# EAGLE schematic nixie-v-rev-b (EAGLE 9.6.2)

## Sheet 1 of 5: USB-C Connector & Power Supply
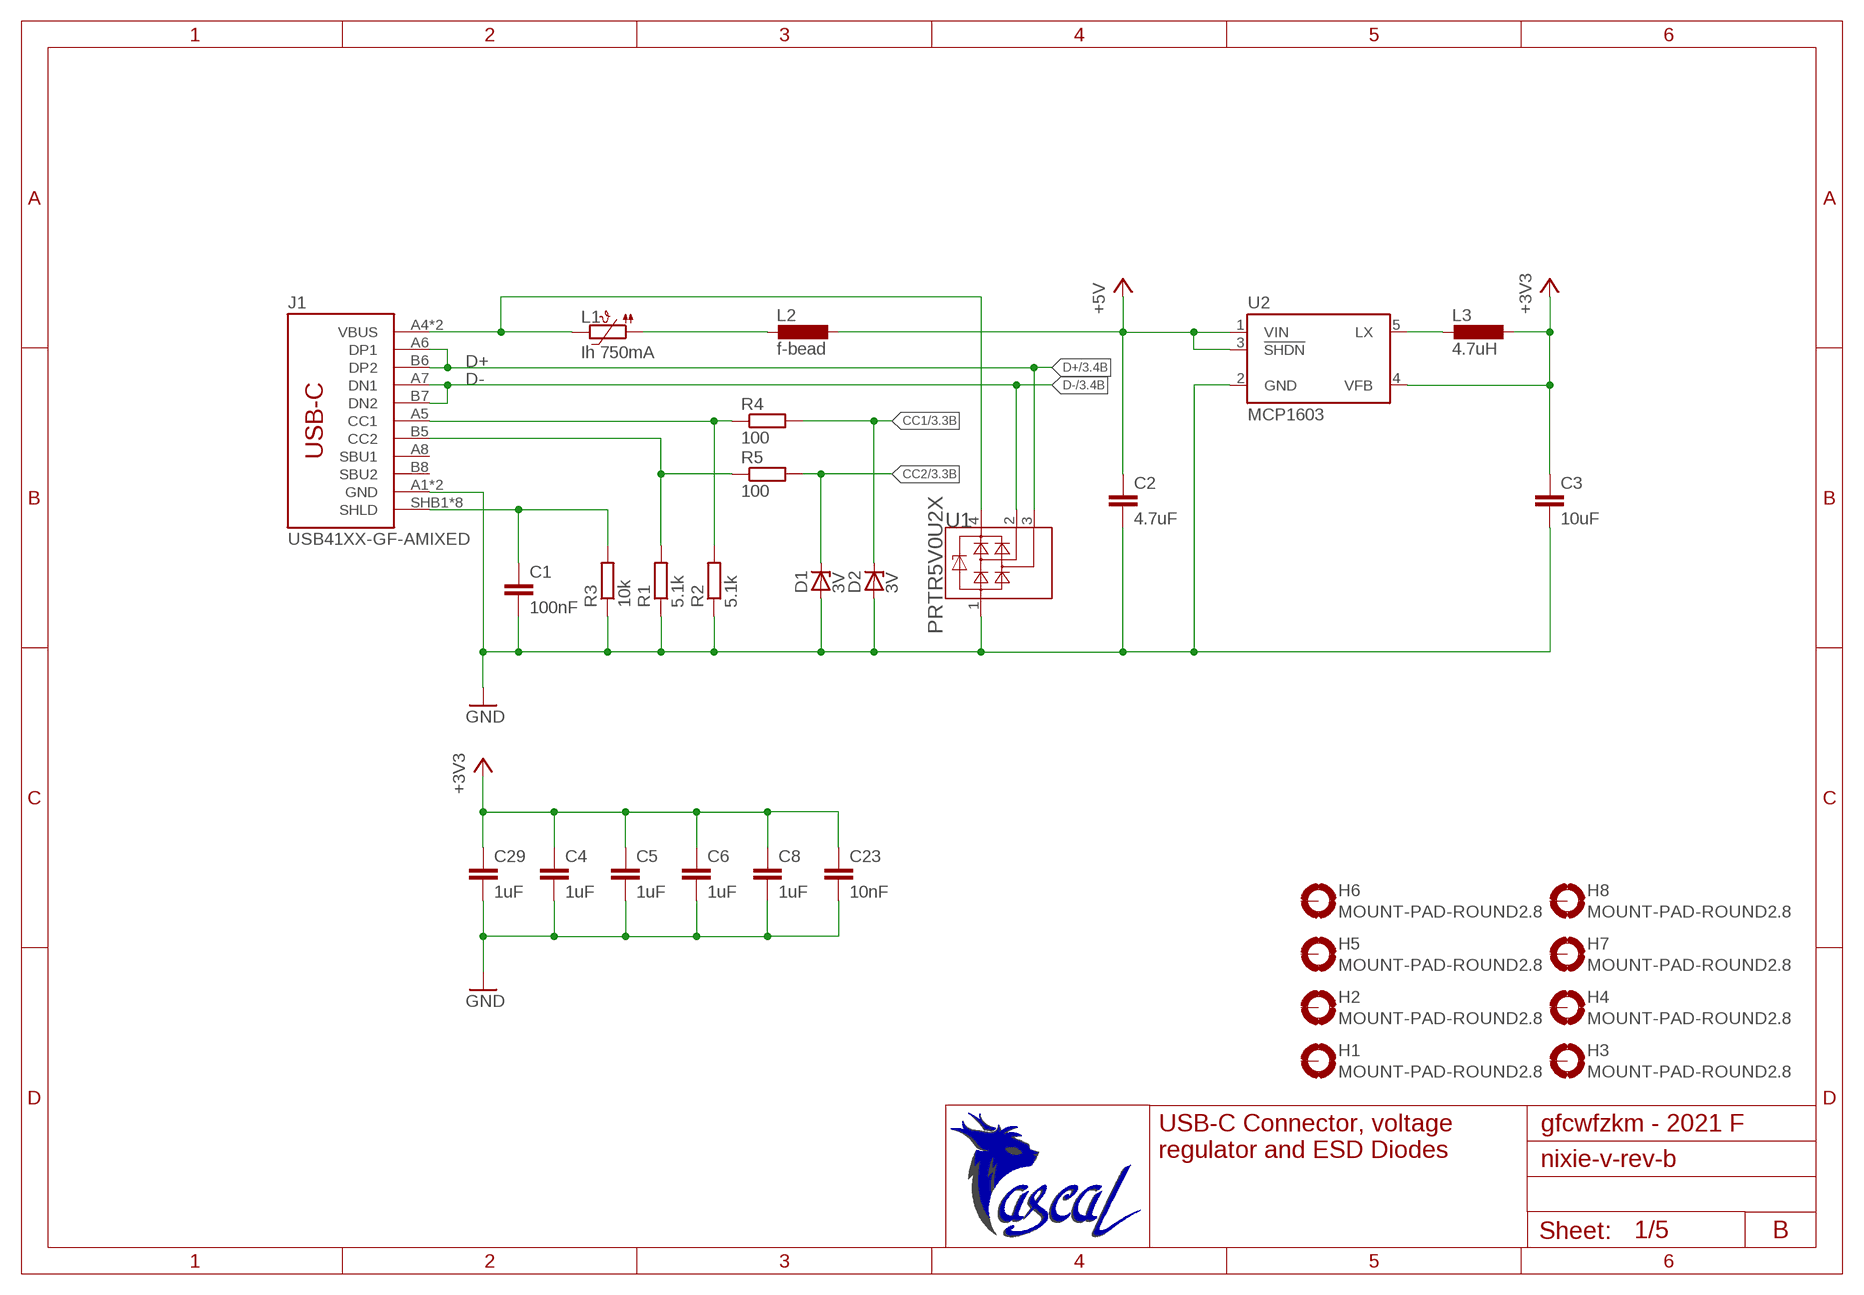
[diagram p0: schematic, sheet 1]

### Parts
C1  100nF  C-EUC0603  [C0603]
C2  4.7uF  C-EUC0805  [C0805]
C3  10uF  C-EUC0805  [C0805]
C4  1uF  C-EUC0603  [C0603]
C5  1uF  C-EUC0603  [C0603]
C6  1uF  C-EUC0603  [C0603]
C8  1uF  C-EUC0603  [C0603]
C23  10nF  C-EUC0603  [C0603]
C29  1uF  C-EUC0603  [C0603]
D1  3V  VESD05A1-02V-G3-08  [SOD-523]
D2  3V  VESD05A1-02V-G3-08  [SOD-523]
H1  MOUNT-PAD-ROUND2.8  [2,8-PAD]
H2  MOUNT-PAD-ROUND2.8  [2,8-PAD]
H3  MOUNT-PAD-ROUND2.8  [2,8-PAD]
H4  MOUNT-PAD-ROUND2.8  [2,8-PAD]
H5  MOUNT-PAD-ROUND2.8  [2,8-PAD]
H6  MOUNT-PAD-ROUND2.8  [2,8-PAD]
H7  MOUNT-PAD-ROUND2.8  [2,8-PAD]
H8  MOUNT-PAD-ROUND2.8  [2,8-PAD]
J1  USB41XX-GF-AMIXED  [USB4105-GF-A]
L1  Ih 750mA  PTC_FUSE0805  [R0805]
L2  f-bead  L-COIL  [R0805]
L3  4.7uH  L1210  [R1210]
R1  5.1k  R-EU_R0603  [R0603]
R2  5.1k  R-EU_R0603  [R0603]
R3  10k  R-EU_R0603  [R0603]
R4  100  R-EU_R0603  [R0603]
R5  100  R-EU_R0603  [R0603]
U1  PRTR5V0U2X  [SOT143B]
U2  MCP1603  [TSOT23-5]
U$1  LOGO_PASCAL_GESELL30MM  [LOGO_30MM]

### Nets
+3V3: C3.1 C4.1 C5.1 C6.1 C8.1 C23.1 C29.1 L3.1 U2.4(VFB) ; also sheet 3
+5V: C2.1 L2.1 U2.1(VIN) U2.3(!SHDN) ; also sheet 2
CC1: D2.C R4.2 ; also sheet 3
CC2: D1.C R5.2 ; also sheet 3
D+: J1.A6(DP1) J1.B6(DP2) U1.3 ; also sheet 3
D-: J1.A7(DN1) J1.B7(DN2) U1.2 ; also sheet 3
GND: C1.2 C2.2 C3.2 C4.2 C5.2 C6.2 C8.2 C23.2 C29.2 D1.A D2.A J1.A1(GND) J1.B1(GND) R1.1 R2.1 R3.1 U1.1 U2.2(GND) ; also sheet 2,3
LX: L3.2 U2.5(LX)
N$1: C1.1 J1.SHB1(SHLD) J1.SHB2(SHLD) J1.SHB3(SHLD) J1.SHB4(SHLD) J1.SHT1(SHLD) J1.SHT2(SHLD) J1.SHT3(SHLD) J1.SHT4(SHLD) R3.2
N$2: J1.B5(CC2) R1.2 R5.1
N$3: J1.A5(CC1) R2.2 R4.1
N$5: L1.1 L2.2
VBUS: J1.A4(VBUS) J1.B4(VBUS) L1.2 U1.4
Unconnected: H1.B2,8(MOUNT) H2.B2,8(MOUNT) H3.B2,8(MOUNT) H4.B2,8(MOUNT) H5.B2,8(MOUNT) H6.B2,8(MOUNT) H7.B2,8(MOUNT) H8.B2,8(MOUNT) J1.A8(SBU1) J1.B8(SBU2)

### Notes on the sheet
- USB-C Connector, voltage
  regulator and ESD Diodes
- gfcwfzkm - 2021 F
- B

## Sheet 2 of 5: High Voltage Nixie Booster
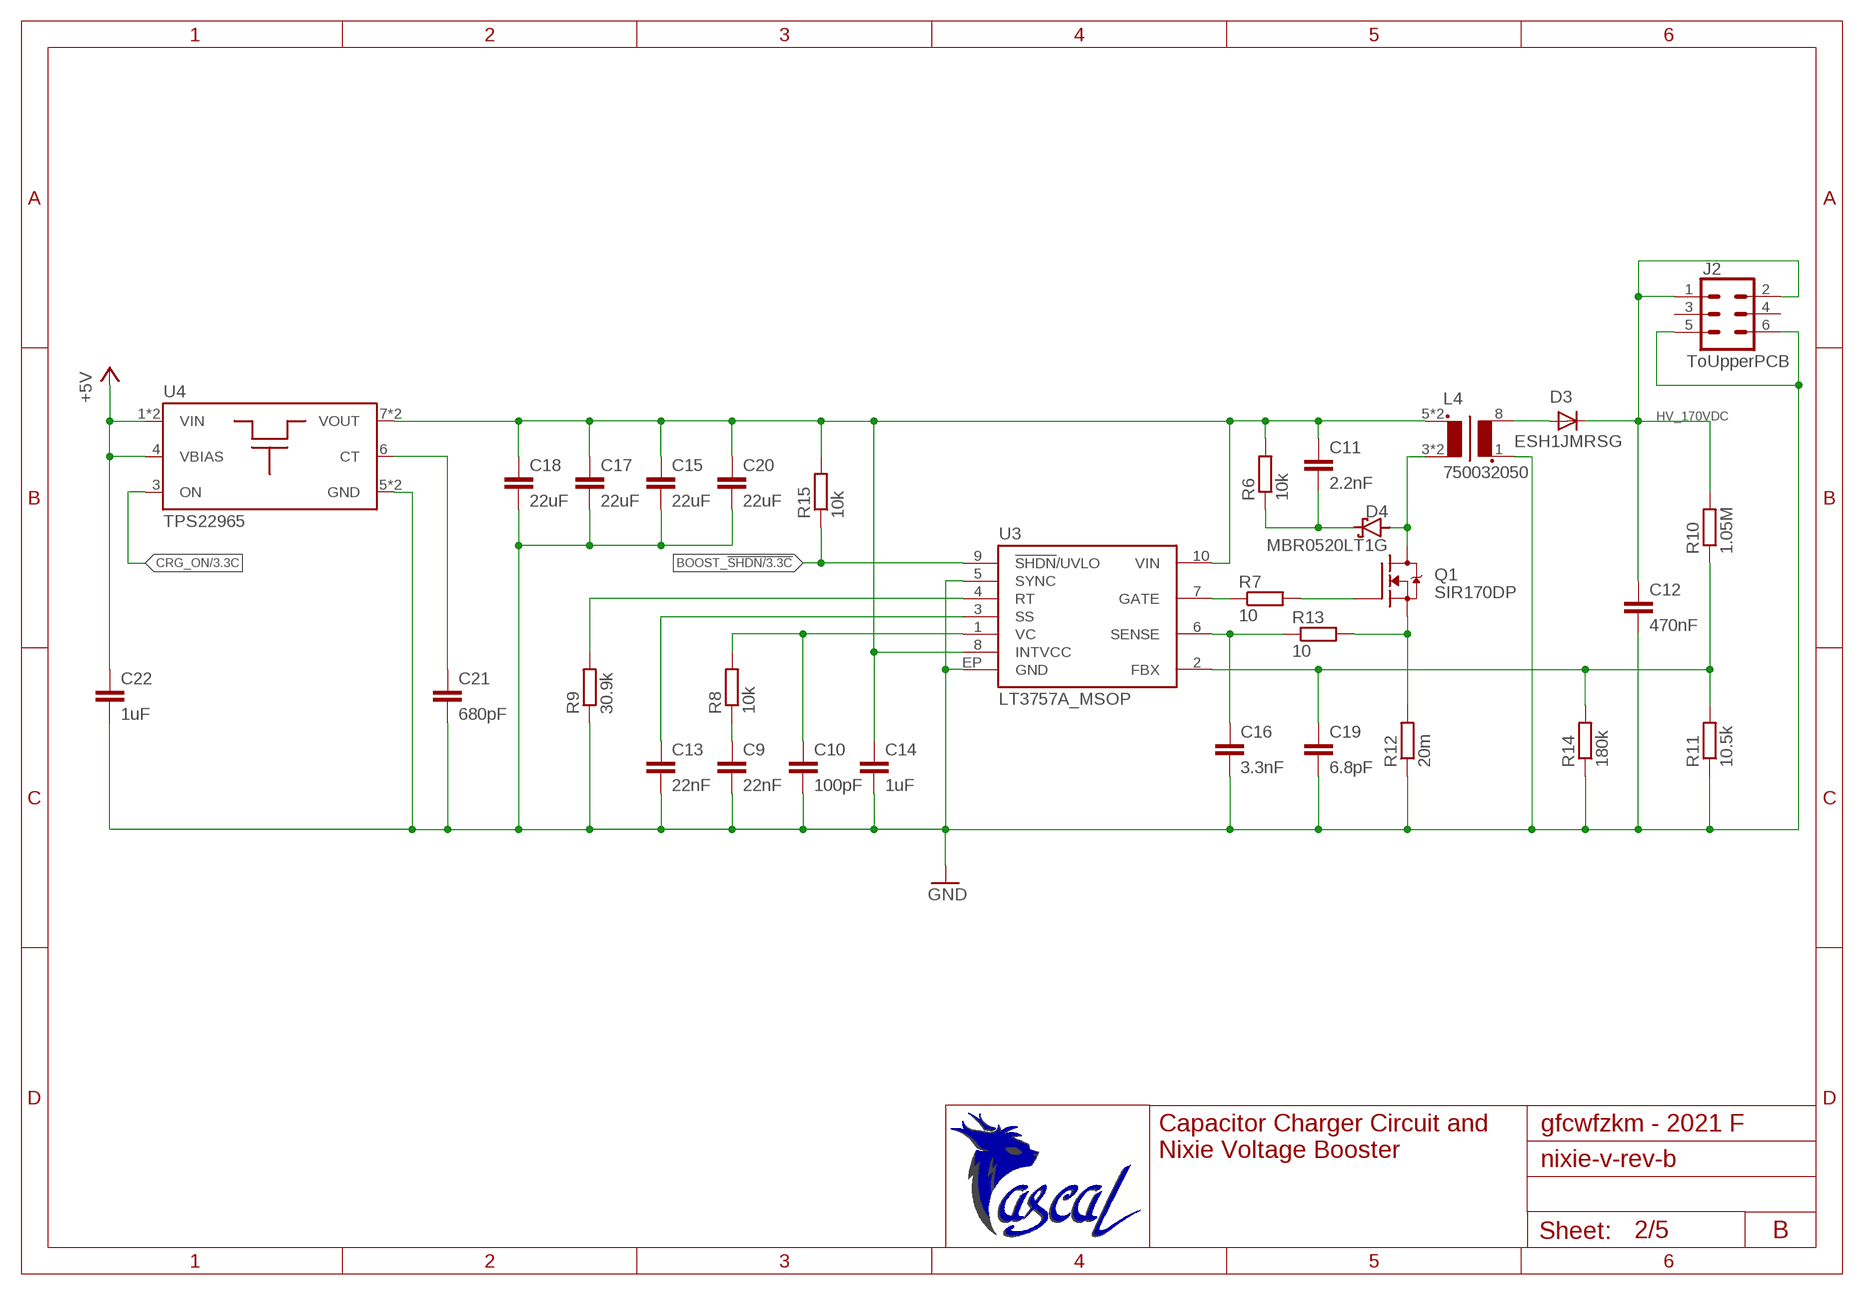
[diagram p1: schematic, sheet 2]

### Parts
C9  22nF  C-EUC0603  [C0603]
C10  100pF  C-EUC0603  [C0603]
C11  2.2nF  C-EUC0603  [C0603]
C12  470nF  C-EUC1812  [C1812]
C13  22nF  C-EUC0603  [C0603]
C14  1uF  C-EUC0603  [C0603]
C15  22uF  C-EUC0805  [C0805]
C16  3.3nF  C-EUC0603  [C0603]
C17  22uF  C-EUC0805  [C0805]
C18  22uF  C-EUC0805  [C0805]
C19  6.8pF  C-EUC0603  [C0603]
C20  22uF  C-EUC0805  [C0805]
C21  680pF  C-EUC0603  [C0603]
C22  1uF  C-EUC0603  [C0603]
D3  ESH1JMRSG  [MICROSMA]
D4  MBR0520LT1G  [SOD-123]
J2  ToUpperPCB  CONN_03X2FEMALE  [2X3]
L4  750032050  [750032050]
Q1  SIR170DP  SIRA36DP  [SO-08_POWERPAK]
R6  10k  R-EU_R0603  [R0603]
R7  10  R-EU_R0603  [R0603]
R8  10k  R-EU_R0603  [R0603]
R9  30.9k  R-EU_R0603  [R0603]
R10  1.05M  R-EU_R0603  [R0603]
R11  10.5k  R-EU_R0603  [R0603]
R12  20m  R-EU_R0805  [R0805]
R13  10  R-EU_R0603  [R0603]
R14  180k  R-EU_R0603  [R0603]
R15  10k  R-EU_R0603  [R0603]
U3  LT3757A_MSOP  [MSOP10_POWER]
U4  TPS22965  [WSON-8]
U$2  LOGO_PASCAL_GESELLEMPTY  [EMPTY]

### Nets
+5V: C22.1 U4.1(VIN) U4.2(VIN) U4.4(VBIAS) ; also sheet 1
BOOST_!SHDN: R15.1 U3.9(!SHDN!/UVLO) ; also sheet 3
CRG_ON: U4.3(ON) ; also sheet 3
FBX: C19.1 R10.1 R11.2 R14.2 U3.2(FBX)
GATE: R7.1 U3.7(GATE)
GND: C9.2 C10.2 C12.2 C13.2 C14.2 C15.2 C16.2 C17.2 C18.2 C19.2 C20.2 C21.2 C22.2 J2.5 J2.6 L4.1(S1) R9.1 R11.1 R12.1 R14.1 U3.5(SYNC) U3.EP(GND) U4.5(GND) U4.TP(GND) ; also sheet 1,3
HV_170VDC: C12.1 D3.C J2.1 J2.2 R10.2
N$4: C11.2 D4.C R6.1
N$6: Q1.4(G) R7.2
N$7: D3.A L4.8(S2)
N$8: C9.1 R8.1
N$9: Q1.1(S) Q1.2(S) Q1.3(S) R12.2 R13.2
N$10: D4.A L4.3(P2) L4.4(P2) Q1.5(D) Q1.6(D) Q1.7(D) Q1.8(D) Q1.THERMAL(D)
N$11: C21.1 U4.6(CT)
RT: R9.2 U3.4(RT)
SENSE: C16.1 R13.1 U3.6(SENSE)
SS: C13.1 U3.3(SS)
SUP_BOOST: C11.1 C14.1 C15.1 C17.1 C18.1 C20.1 L4.5(P1) L4.6(P1) R6.2 R15.2 U3.8(INTVCC) U3.10(VIN) U4.7(VOUT) U4.8(VOUT)
VC: C10.1 R8.2 U3.1(VC)
Unconnected: J2.3 J2.4

### Notes on the sheet
- Capacitor Charger Circuit and
  Nixie Voltage Booster
- gfcwfzkm - 2021 F
- B

## Sheet 3 of 5: RISC-V Micro, Buttons & RTC
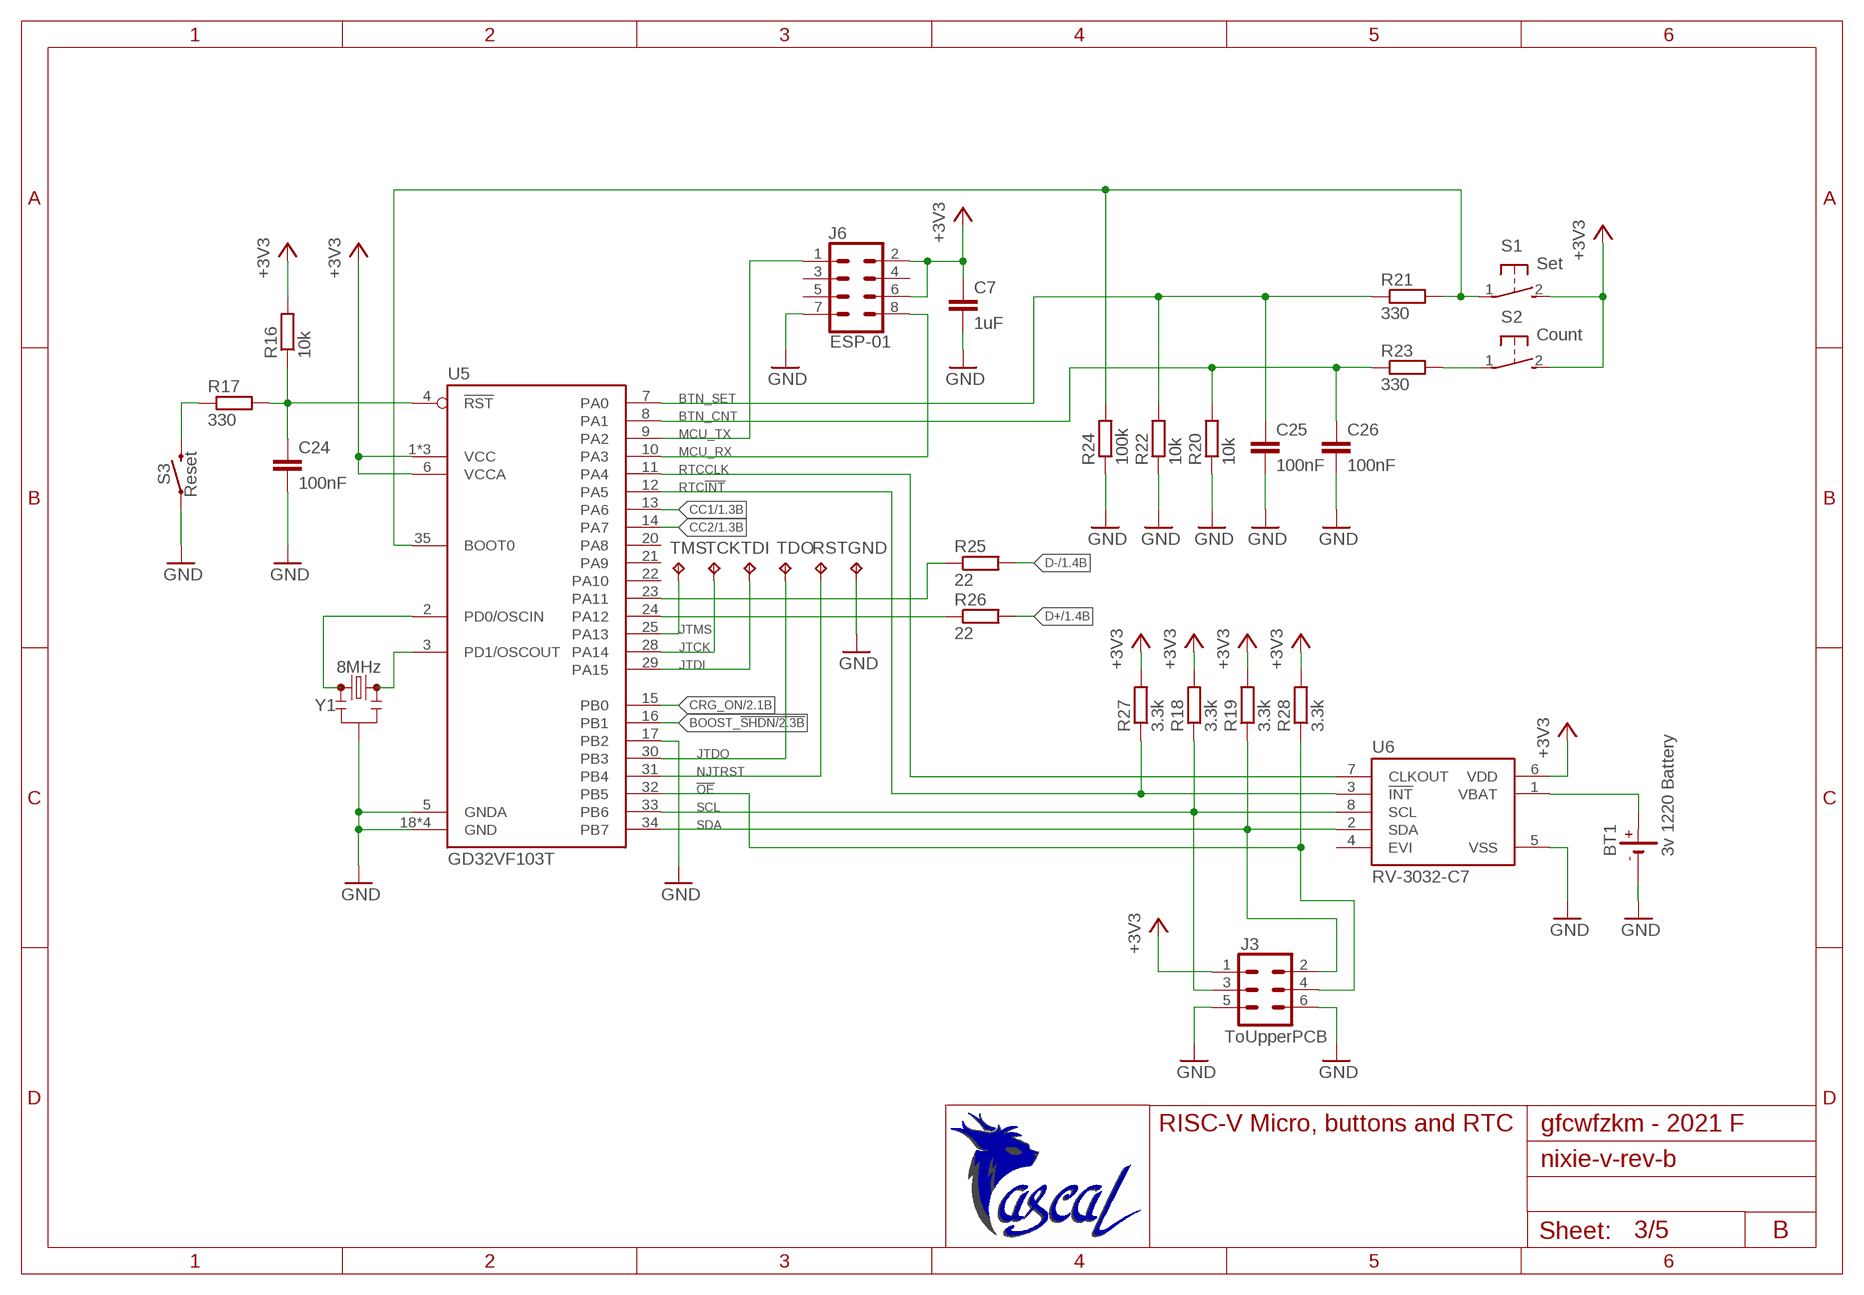
[diagram p2: schematic, sheet 3]

### Parts
BT1  3v 1220 Battery  BATTERY1056_KEYSTONE  [CH291-1220LF]
C7  1uF  C-EUC0603  [C0603]
C24  100nF  C-EUC0603  [C0603]
C25  100nF  C-EUC0603  [C0603]
C26  100nF  C-EUC0603  [C0603]
GND  TPB1,27  [B1,27]
J3  ToUpperPCB  CONN_03X2FEMALE  [2X3]
J6  ESP-01  CONN_04X2  [2X4]
R16  10k  R-EU_R0603  [R0603]
R17  330  R-EU_R0603  [R0603]
R18  3.3k  R-EU_R0603  [R0603]
R19  3.3k  R-EU_R0603  [R0603]
R20  10k  R-EU_R0603  [R0603]
R21  330  R-EU_R0603  [R0603]
R22  10k  R-EU_R0603  [R0603]
R23  330  R-EU_R0603  [R0603]
R24  100k  R-EU_R0603  [R0603]
R25  22  R-EU_R0603  [R0603]
R26  22  R-EU_R0603  [R0603]
R27  3.3k  R-EU_R0603  [R0603]
R28  3.3k  R-EU_R0603  [R0603]
RST  TPB1,27  [B1,27]
S1  Set  31-XX  [B3F-31XX]
S2  Count  31-XX  [B3F-31XX]
S3  Reset  MOMENTARY-SWITCH-SPST-SMD-6.0X3.5MM  [TACTILE_SWITCH_SMD_6.0X3.5MM]
TCK  TPB1,27  [B1,27]
TDI  TPB1,27  [B1,27]
TDO  TPB1,27  [B1,27]
TMS  TPB1,27  [B1,27]
U5  GD32VF103T  [QFN-36]
U6  RV-3032-C7  [RV-3028-C7]
U$3  LOGO_PASCAL_GESELLEMPTY  [EMPTY]
Y1  8MHz  RESONATOR-8MHZSMD_3.2X1.3  [RESONATOR-SMD-3.2X1.3]

### Nets
!OE: J3.4 R28.1 U5.32(PB5)
+3V3: C7.1 J3.1 J6.2 J6.6 R16.2 R18.2 R19.2 R27.2 R28.2 S1.2(S) S2.2(S) U5.1(VCC) U5.6(VCCA) U5.19(VCC) U5.27(VCC) U6.6(VDD) ; also sheet 1
BOOST_!SHDN: U5.16(PB1) ; also sheet 2
BTN_CNT: C26.1 R20.2 R23.1 U5.8(PA1)
BTN_SET: C25.1 R21.1 R22.2 U5.7(PA0)
CC1: U5.13(PA6) ; also sheet 1
CC2: U5.14(PA7) ; also sheet 1
CRG_ON: U5.15(PB0) ; also sheet 2
D+: R26.2 ; also sheet 1
D-: R25.2 ; also sheet 1
GND: BT1.- C7.2 C24.2 C25.2 C26.2 GND.TP J3.5 J3.6 J6.7 R20.1 R22.1 R24.1 S3.1 U5.5(GNDA) U5.17(PB2) U5.18(GND) U5.26(GND) U5.36(GND) U5.EP(GND) U6.5(VSS) Y1.2 ; also sheet 1,2
JTCK: TCK.TP U5.28(PA14)
JTDI: TDI.TP U5.29(PA15)
JTDO: TDO.TP U5.30(PB3)
JTMS: TMS.TP U5.25(PA13)
MCU_RX: J6.8 U5.10(PA3)
MCU_TX: J6.1 U5.9(PA2)
N$12: C24.1 R16.1 R17.2 U5.4(!RST)
N$17: R26.1 U5.24(PA12)
N$18: R23.2 S2.1(P)
N$19: U5.3(PD1/OSCOUT) Y1.3
N$20: R21.2 R24.2 S1.1(P) U5.35(BOOT0)
N$21: R17.1 S3.2
N$22: U5.2(PD0/OSCIN) Y1.1
N$23: R25.1 U5.23(PA11)
N$29: BT1.+ U6.1(VBAT)
NJTRST: RST.TP U5.31(PB4)
RTC!INT: R27.1 U5.12(PA5) U6.3(!INT)
RTCCLK: U5.11(PA4) U6.7(CLKOUT)
SCL: J3.3 R18.1 U5.33(PB6) U6.8(SCL)
SDA: J3.2 R19.1 U5.34(PB7) U6.2(SDA)
Unconnected: J6.3 J6.4 J6.5 U5.20(PA8) U5.21(PA9) U5.22(PA10) U6.4(EVI)

### Notes on the sheet
- RISC-V Micro, buttons and RTC
- gfcwfzkm - 2021 F
- B

## Sheet 4 of 5: Nixie Tubes & Drivers (Mins)
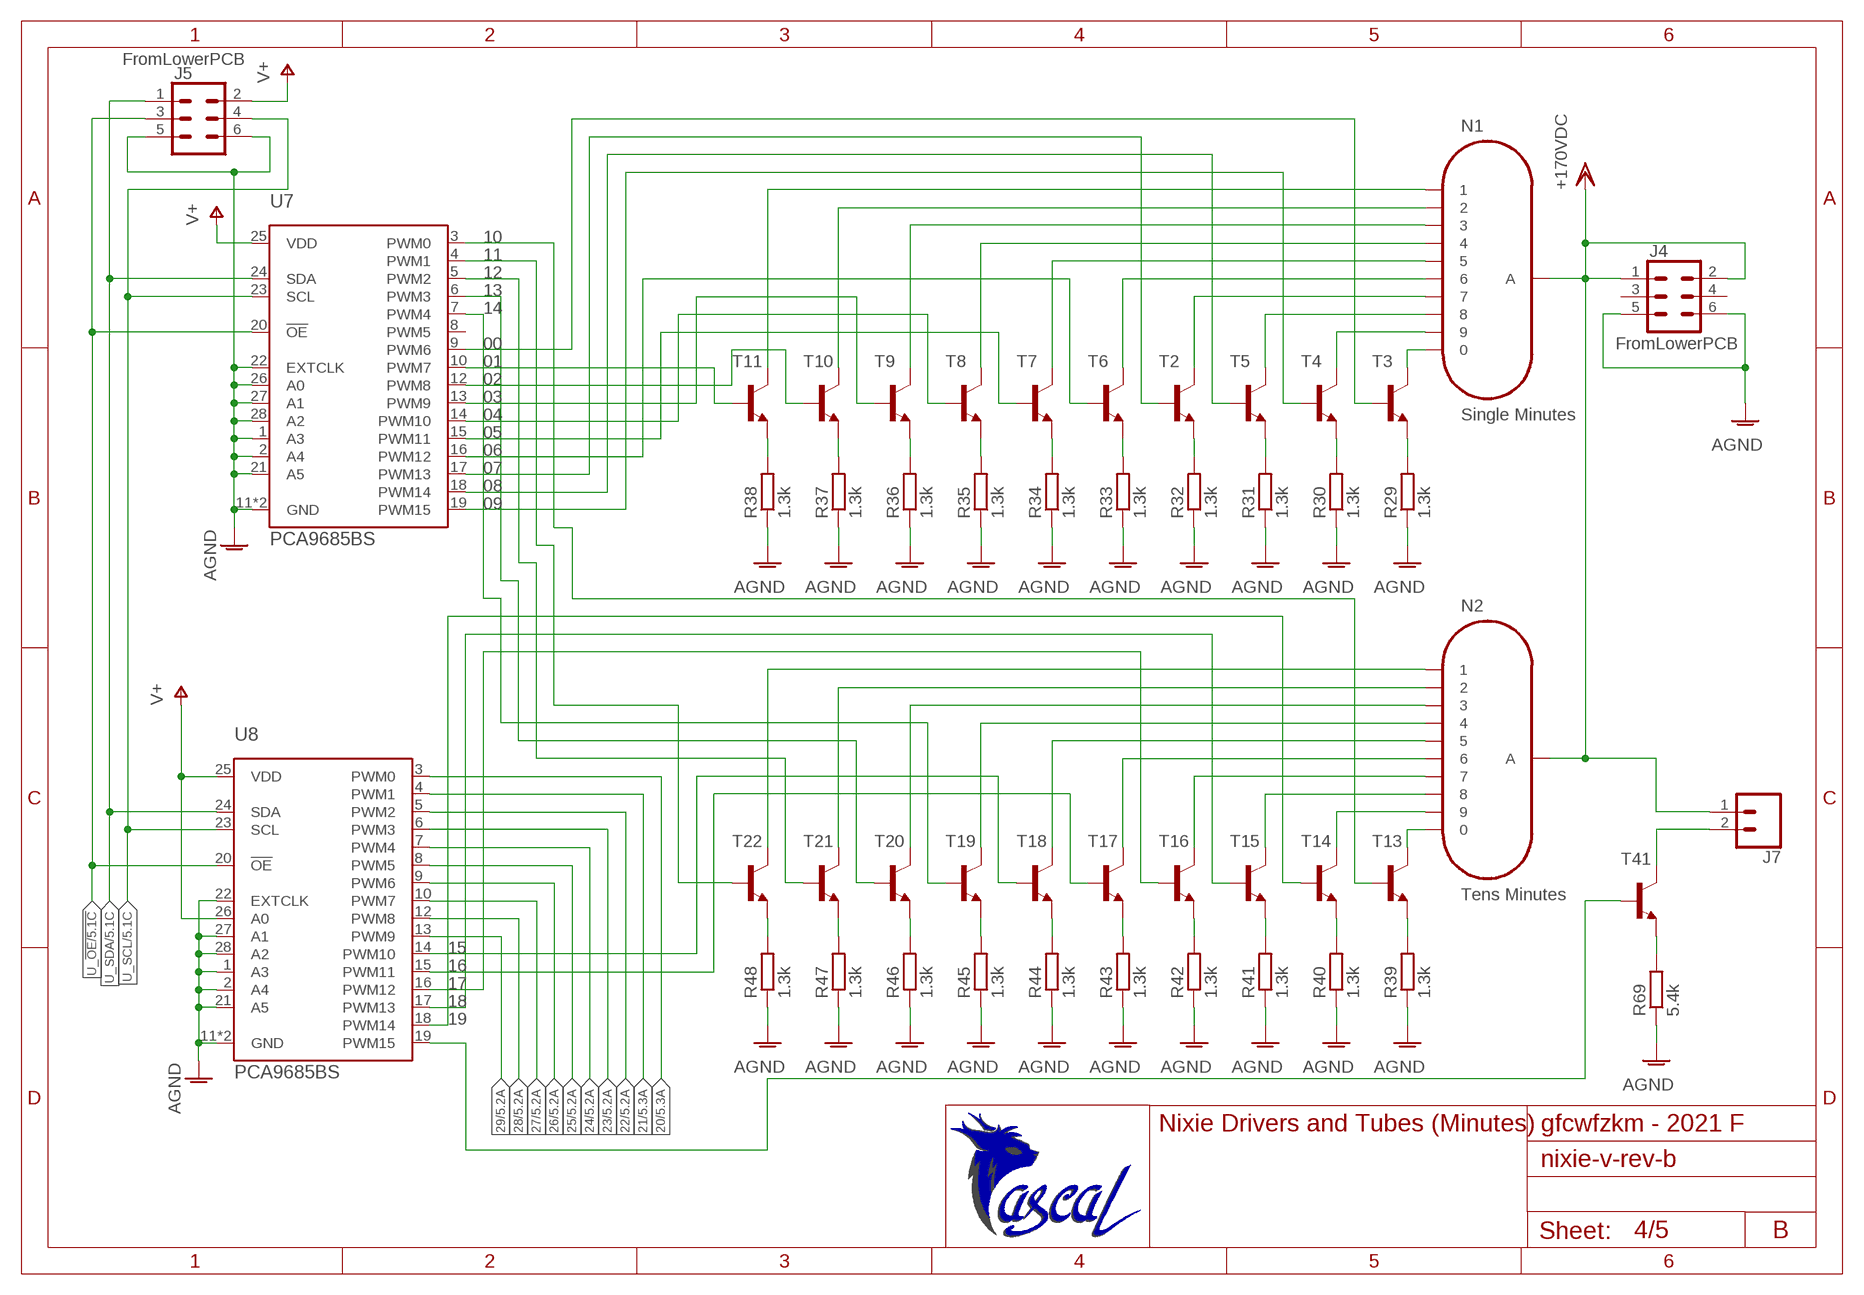
[diagram p3: schematic, sheet 4]

### Parts
J4  FromLowerPCB  CONN_03X2FEMALE  [2X3]
J5  FromLowerPCB  CONN_03X2FEMALE  [2X3]
J7  CONN_02  [1X02]
N1  Single Minutes  IN-8SMALL  [IN-8]
N2  Tens Minutes  IN-8SMALL  [IN-8]
R29  1.3k  R-EU_R0603  [R0603]
R30  1.3k  R-EU_R0603  [R0603]
R31  1.3k  R-EU_R0603  [R0603]
R32  1.3k  R-EU_R0603  [R0603]
R33  1.3k  R-EU_R0603  [R0603]
R34  1.3k  R-EU_R0603  [R0603]
R35  1.3k  R-EU_R0603  [R0603]
R36  1.3k  R-EU_R0603  [R0603]
R37  1.3k  R-EU_R0603  [R0603]
R38  1.3k  R-EU_R0603  [R0603]
R39  1.3k  R-EU_R0603  [R0603]
R40  1.3k  R-EU_R0603  [R0603]
R41  1.3k  R-EU_R0603  [R0603]
R42  1.3k  R-EU_R0603  [R0603]
R43  1.3k  R-EU_R0603  [R0603]
R44  1.3k  R-EU_R0603  [R0603]
R45  1.3k  R-EU_R0603  [R0603]
R46  1.3k  R-EU_R0603  [R0603]
R47  1.3k  R-EU_R0603  [R0603]
R48  1.3k  R-EU_R0603  [R0603]
R69  5.4k  R-EU_R0603  [R0603]
T2  MSD42WT1G  [SC70-3-R]
T3  MSD42WT1G  [SC70-3-R]
T4  MSD42WT1G  [SC70-3-R]
T5  MSD42WT1G  [SC70-3-R]
T6  MSD42WT1G  [SC70-3-R]
T7  MSD42WT1G  [SC70-3-R]
T8  MSD42WT1G  [SC70-3-R]
T9  MSD42WT1G  [SC70-3-R]
T10  MSD42WT1G  [SC70-3-R]
T11  MSD42WT1G  [SC70-3-R]
T13  MSD42WT1G  [SC70-3-R]
T14  MSD42WT1G  [SC70-3-R]
T15  MSD42WT1G  [SC70-3-R]
T16  MSD42WT1G  [SC70-3-R]
T17  MSD42WT1G  [SC70-3-R]
T18  MSD42WT1G  [SC70-3-R]
T19  MSD42WT1G  [SC70-3-R]
T20  MSD42WT1G  [SC70-3-R]
T21  MSD42WT1G  [SC70-3-R]
T22  MSD42WT1G  [SC70-3-R]
T41  MSD42WT1G  [SC70-3-R]
U7  PCA9685BS  [HVQFN28]
U8  PCA9685BS  [HVQFN28]
U$4  LOGO_PASCAL_GESELLEMPTY  [EMPTY]

### Nets
00: T3.1(B) U7.9(PWM6)
01: T11.1(B) U7.10(PWM7)
02: T10.1(B) U7.12(PWM8)
03: T9.1(B) U7.13(PWM9)
04: T8.1(B) U7.14(PWM10)
05: T7.1(B) U7.15(PWM11)
06: T6.1(B) U7.16(PWM12)
07: T2.1(B) U7.17(PWM13)
08: T5.1(B) U7.18(PWM14)
09: T4.1(B) U7.19(PWM15)
10: T13.1(B) U7.3(PWM0)
11: T22.1(B) U7.4(PWM1)
12: T21.1(B) U7.5(PWM2)
13: T20.1(B) U7.6(PWM3)
14: T19.1(B) U7.7(PWM4)
15: T18.1(B) U8.14(PWM10)
16: T17.1(B) U8.15(PWM11)
17: T16.1(B) U8.16(PWM12)
18: T15.1(B) U8.17(PWM13)
19: T14.1(B) U8.18(PWM14)
20: U8.3(PWM0) ; also sheet 5
21: U8.4(PWM1) ; also sheet 5
22: U8.5(PWM2) ; also sheet 5
23: U8.6(PWM3) ; also sheet 5
24: U8.7(PWM4) ; also sheet 5
25: U8.8(PWM5) ; also sheet 5
26: U8.9(PWM6) ; also sheet 5
27: U8.10(PWM7) ; also sheet 5
28: U8.12(PWM8) ; also sheet 5
29: U8.13(PWM9) ; also sheet 5
+170VDC: J4.1 J4.2 J7.1 N1.A N2.A ; also sheet 5
AGND: J4.5 J4.6 J5.5 J5.6 R29.1 R30.1 R31.1 R32.1 R33.1 R34.1 R35.1 R36.1 R37.1 R38.1 R39.1 R40.1 R41.1 R42.1 R43.1 R44.1 R45.1 R46.1 R47.1 R48.1 R69.1 U7.1(A3) U7.2(A4) U7.11(GND) U7.21(A5) U7.22(EXTCLK) U7.26(A0) U7.27(A1) U7.28(A2) U7.TH(GND) U8.1(A3) U8.2(A4) U8.11(GND) U8.21(A5) U8.22(EXTCLK) U8.27(A1) U8.28(A2) U8.TH(GND) ; also sheet 5
N$13: N1.0 T3.3(C)
N$14: J7.2 T41.3(C)
N$15: R69.2 T41.2(E)
N$16: T41.1(B) U8.19(PWM15)
N$24: N1.9 T4.3(C)
N$25: N1.8 T5.3(C)
N$26: N1.7 T2.3(C)
N$28: N1.6 T6.3(C)
N$30: N1.5 T7.3(C)
N$31: N1.4 T8.3(C)
N$32: N1.3 T9.3(C)
N$33: N1.2 T10.3(C)
N$34: N1.1 T11.3(C)
N$35: R29.2 T3.2(E)
N$36: R38.2 T11.2(E)
N$37: R37.2 T10.2(E)
N$38: R36.2 T9.2(E)
N$39: R35.2 T8.2(E)
N$40: R34.2 T7.2(E)
N$41: R33.2 T6.2(E)
N$42: R32.2 T2.2(E)
N$43: R31.2 T5.2(E)
N$44: R30.2 T4.2(E)
N$55: N2.0 T13.3(C)
N$56: N2.9 T14.3(C)
N$57: N2.8 T15.3(C)
N$58: N2.7 T16.3(C)
N$59: N2.6 T17.3(C)
N$60: N2.5 T18.3(C)
N$61: N2.4 T19.3(C)
N$62: N2.3 T20.3(C)
N$63: N2.2 T21.3(C)
N$64: N2.1 T22.3(C)
N$65: R39.2 T13.2(E)
N$66: R48.2 T22.2(E)
N$67: R47.2 T21.2(E)
N$68: R46.2 T20.2(E)
N$69: R45.2 T19.2(E)
N$70: R44.2 T18.2(E)
N$71: R43.2 T17.2(E)
N$72: R42.2 T16.2(E)
N$73: R41.2 T15.2(E)
N$74: R40.2 T14.2(E)
U_!OE: J5.3 U7.20(!OE) U8.20(!OE) ; also sheet 5
U_SCL: J5.4 U7.23(SCL) U8.23(SCL) ; also sheet 5
U_SDA: J5.1 U7.24(SDA) U8.24(SDA) ; also sheet 5
V+: J5.2 U7.25(VDD) U8.25(VDD) U8.26(A0) ; also sheet 5
Unconnected: J4.3 J4.4 U7.8(PWM5)

### Notes on the sheet
- Nixie Drivers and Tubes (Minutes)
- gfcwfzkm - 2021 F
- B

## Sheet 5 of 5: Nixie Tubes & Drivers (Hours)
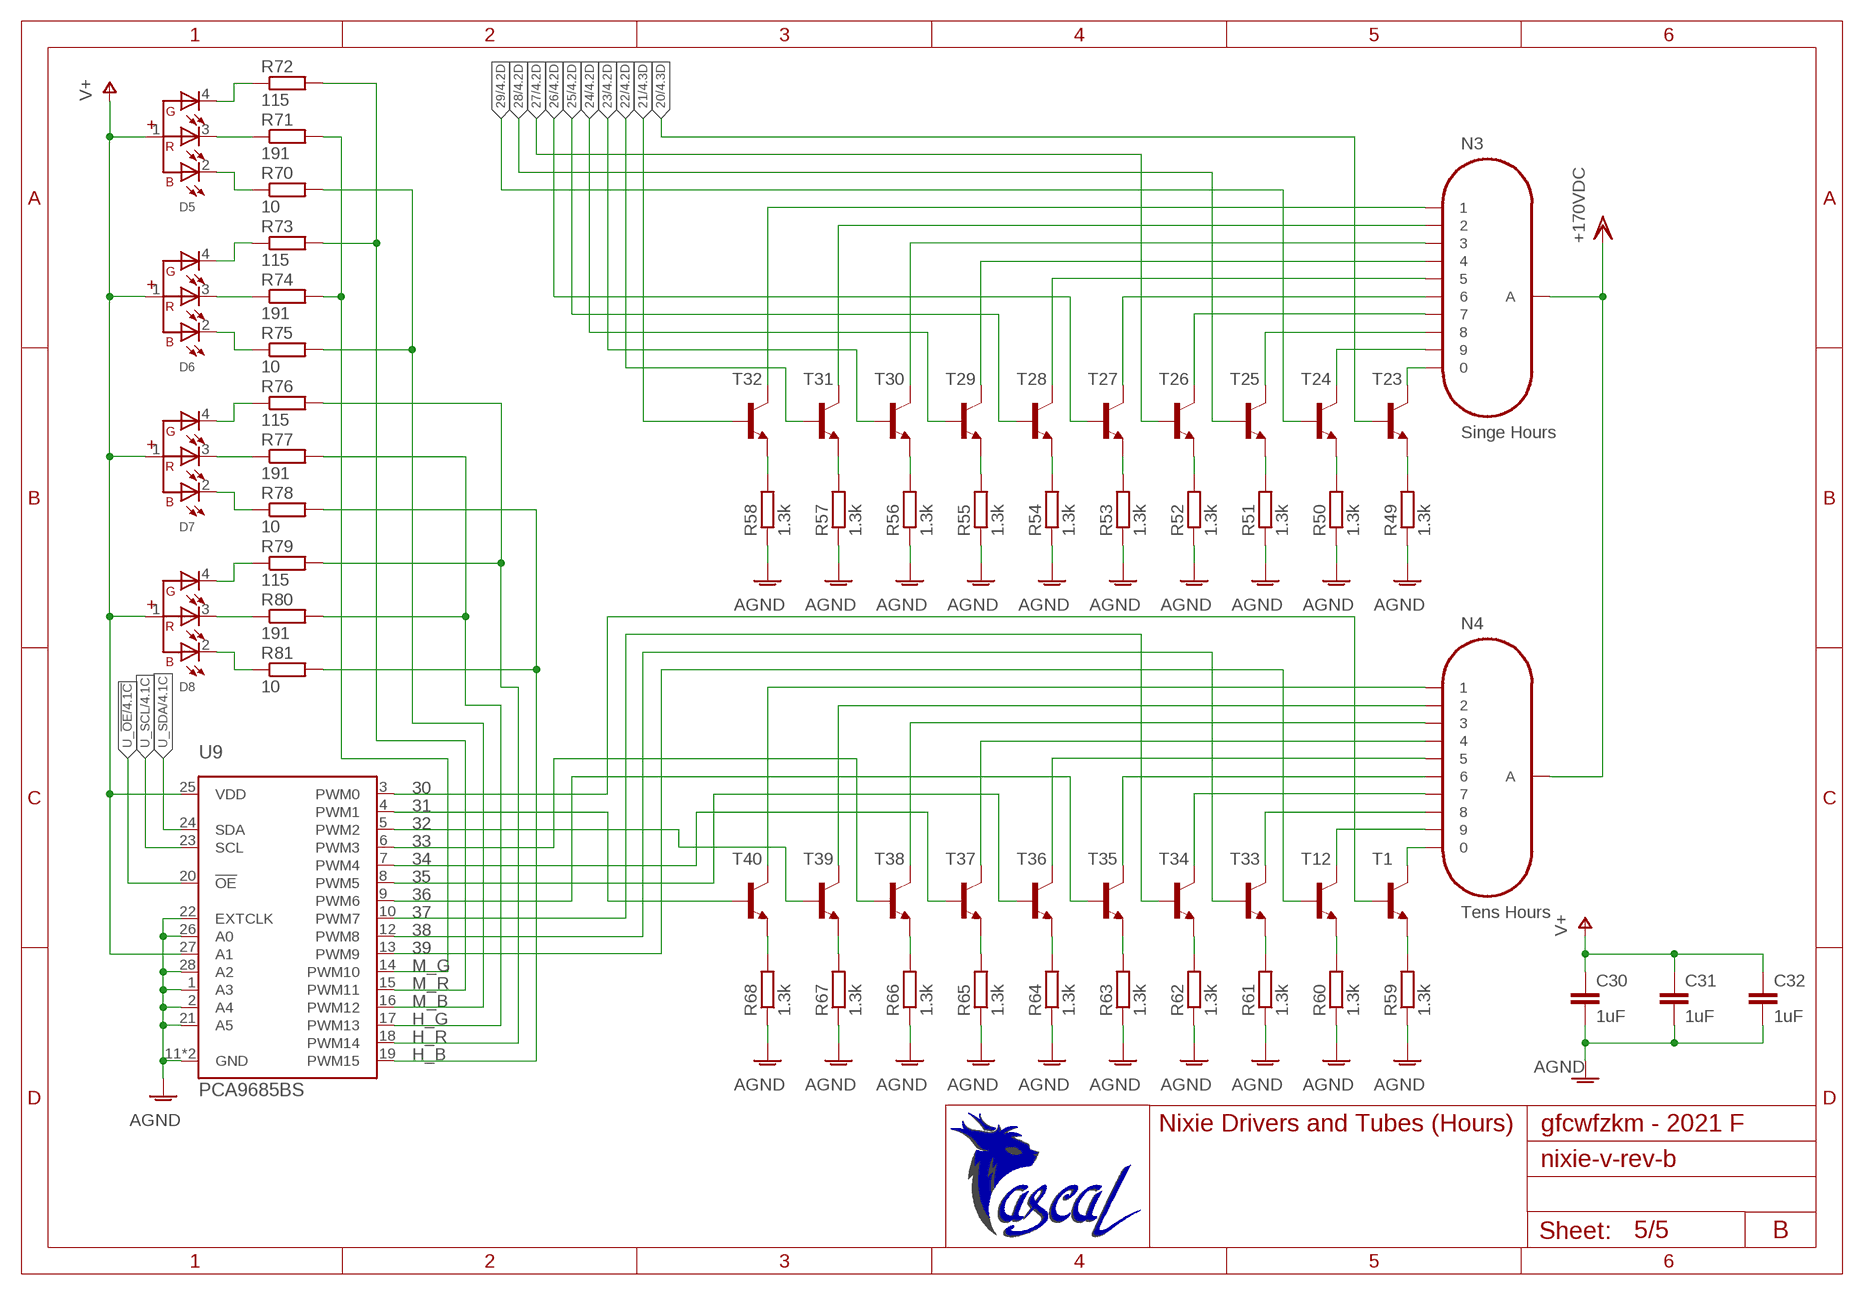
[diagram p4: schematic, sheet 5]

### Parts
C30  1uF  C-EUC0603  [C0603]
C31  1uF  C-EUC0603  [C0603]
C32  1uF  C-EUC0603  [C0603]
D5  WL-SFRW_1206_REC_156120M173000_NOR  [WL-SFRW_1206_REC]
D6  WL-SFRW_1206_REC_156120M173000_NOR  [WL-SFRW_1206_REC]
D7  WL-SFRW_1206_REC_156120M173000_NOR  [WL-SFRW_1206_REC]
D8  WL-SFRW_1206_REC_156120M173000_NOR  [WL-SFRW_1206_REC]
N3  Singe Hours  IN-8SMALL  [IN-8]
N4  Tens Hours  IN-8SMALL  [IN-8]
R49  1.3k  R-EU_R0603  [R0603]
R50  1.3k  R-EU_R0603  [R0603]
R51  1.3k  R-EU_R0603  [R0603]
R52  1.3k  R-EU_R0603  [R0603]
R53  1.3k  R-EU_R0603  [R0603]
R54  1.3k  R-EU_R0603  [R0603]
R55  1.3k  R-EU_R0603  [R0603]
R56  1.3k  R-EU_R0603  [R0603]
R57  1.3k  R-EU_R0603  [R0603]
R58  1.3k  R-EU_R0603  [R0603]
R59  1.3k  R-EU_R0603  [R0603]
R60  1.3k  R-EU_R0603  [R0603]
R61  1.3k  R-EU_R0603  [R0603]
R62  1.3k  R-EU_R0603  [R0603]
R63  1.3k  R-EU_R0603  [R0603]
R64  1.3k  R-EU_R0603  [R0603]
R65  1.3k  R-EU_R0603  [R0603]
R66  1.3k  R-EU_R0603  [R0603]
R67  1.3k  R-EU_R0603  [R0603]
R68  1.3k  R-EU_R0603  [R0603]
R70  10  R-EU_R0603  [R0603]
R71  191  R-EU_R0603  [R0603]
R72  115  R-EU_R0603  [R0603]
R73  115  R-EU_R0603  [R0603]
R74  191  R-EU_R0603  [R0603]
R75  10  R-EU_R0603  [R0603]
R76  115  R-EU_R0603  [R0603]
R77  191  R-EU_R0603  [R0603]
R78  10  R-EU_R0603  [R0603]
R79  115  R-EU_R0603  [R0603]
R80  191  R-EU_R0603  [R0603]
R81  10  R-EU_R0603  [R0603]
T1  MSD42WT1G  [SC70-3-R]
T12  MSD42WT1G  [SC70-3-R]
T23  MSD42WT1G  [SC70-3-R]
T24  MSD42WT1G  [SC70-3-R]
T25  MSD42WT1G  [SC70-3-R]
T26  MSD42WT1G  [SC70-3-R]
T27  MSD42WT1G  [SC70-3-R]
T28  MSD42WT1G  [SC70-3-R]
T29  MSD42WT1G  [SC70-3-R]
T30  MSD42WT1G  [SC70-3-R]
T31  MSD42WT1G  [SC70-3-R]
T32  MSD42WT1G  [SC70-3-R]
T33  MSD42WT1G  [SC70-3-R]
T34  MSD42WT1G  [SC70-3-R]
T35  MSD42WT1G  [SC70-3-R]
T36  MSD42WT1G  [SC70-3-R]
T37  MSD42WT1G  [SC70-3-R]
T38  MSD42WT1G  [SC70-3-R]
T39  MSD42WT1G  [SC70-3-R]
T40  MSD42WT1G  [SC70-3-R]
U9  PCA9685BS  [HVQFN28]
U$5  LOGO_PASCAL_GESELLEMPTY  [EMPTY]

### Nets
20: T23.1(B) ; also sheet 4
21: T32.1(B) ; also sheet 4
22: T31.1(B) ; also sheet 4
23: T30.1(B) ; also sheet 4
24: T29.1(B) ; also sheet 4
25: T28.1(B) ; also sheet 4
26: T27.1(B) ; also sheet 4
27: T26.1(B) ; also sheet 4
28: T25.1(B) ; also sheet 4
29: T24.1(B) ; also sheet 4
30: T1.1(B) U9.3(PWM0)
31: T40.1(B) U9.4(PWM1)
32: T39.1(B) U9.5(PWM2)
33: T38.1(B) U9.6(PWM3)
34: T37.1(B) U9.7(PWM4)
35: T36.1(B) U9.8(PWM5)
36: T35.1(B) U9.9(PWM6)
37: T34.1(B) U9.10(PWM7)
38: T33.1(B) U9.12(PWM8)
39: T12.1(B) U9.13(PWM9)
+170VDC: N3.A N4.A ; also sheet 4
AGND: C30.2 C31.2 C32.2 R49.1 R50.1 R51.1 R52.1 R53.1 R54.1 R55.1 R56.1 R57.1 R58.1 R59.1 R60.1 R61.1 R62.1 R63.1 R64.1 R65.1 R66.1 R67.1 R68.1 U9.1(A3) U9.2(A4) U9.11(GND) U9.21(A5) U9.22(EXTCLK) U9.26(A0) U9.28(A2) U9.TH(GND) ; also sheet 4
H_B: R78.2 R81.2 U9.19(PWM15)
H_G: R77.2 R80.2 U9.17(PWM13)
H_R: R76.2 R79.2 U9.18(PWM14)
M_B: R70.2 R75.2 U9.16(PWM12)
M_G: R71.2 R74.2 U9.14(PWM10)
M_R: R72.2 R73.2 U9.15(PWM11)
N$45: N3.0 T23.3(C)
N$46: N3.9 T24.3(C)
N$47: N3.8 T25.3(C)
N$48: N3.7 T26.3(C)
N$49: N3.6 T27.3(C)
N$50: N3.5 T28.3(C)
N$51: N3.4 T29.3(C)
N$52: N3.3 T30.3(C)
N$53: N3.2 T31.3(C)
N$54: N3.1 T32.3(C)
N$75: R49.2 T23.2(E)
N$76: R58.2 T32.2(E)
N$77: R57.2 T31.2(E)
N$78: R56.2 T30.2(E)
N$79: R55.2 T29.2(E)
N$80: R54.2 T28.2(E)
N$81: R53.2 T27.2(E)
N$82: R52.2 T26.2(E)
N$83: R51.2 T25.2(E)
N$84: R50.2 T24.2(E)
N$85: N4.0 T1.3(C)
N$86: N4.9 T12.3(C)
N$87: N4.8 T33.3(C)
N$88: N4.7 T34.3(C)
N$89: N4.6 T35.3(C)
N$90: N4.5 T36.3(C)
N$91: N4.4 T37.3(C)
N$92: N4.3 T38.3(C)
N$93: N4.2 T39.3(C)
N$94: N4.1 T40.3(C)
N$95: R59.2 T1.2(E)
N$96: R68.2 T40.2(E)
N$97: R67.2 T39.2(E)
N$98: R66.2 T38.2(E)
N$99: R65.2 T37.2(E)
N$100: R64.2 T36.2(E)
N$101: R63.2 T35.2(E)
N$102: R62.2 T34.2(E)
N$103: R61.2 T33.2(E)
N$104: R60.2 T12.2(E)
N$105: D5.4(G-) R72.1
N$106: D5.3(R-) R71.1
N$107: D5.2(B-) R70.1
N$108: D8.4(G-) R79.1
N$109: D8.3(R-) R80.1
N$110: D8.2(B-) R81.1
N$111: D6.4(G-) R73.1
N$112: D6.3(R-) R74.1
N$113: D6.2(B-) R75.1
N$114: D7.2(B-) R78.1
N$115: D7.3(R-) R77.1
N$116: D7.4(G-) R76.1
U_!OE: U9.20(!OE) ; also sheet 4
U_SCL: U9.23(SCL) ; also sheet 4
U_SDA: U9.24(SDA) ; also sheet 4
V+: C30.1 C31.1 C32.1 D5.1(+) D6.1(+) D7.1(+) D8.1(+) U9.25(VDD) U9.27(A1) ; also sheet 4

### Notes on the sheet
- Nixie Drivers and Tubes (Hours)
- gfcwfzkm - 2021 F
- B

## Library data of the parts
BT1 = Pascal_Library:BATTERY: 1056: https://www.digikey.ch/product-detail/de/keystone-electronics/1056/36-1056-ND/2020198
C1-C26 C29-C32 = rcl:C-EU: CAPACITOR, European symbol; SPICEPREFIX: C
D1 D2 = Elektroniker MGB:VESD05A1-02V-G3-08
D3 = Pascal_Library:ESH1JMRSG
D4 = Diodes:MBR0520LT1G: DIODE SCHOTTKY 20V 500MA SOD123 Manufacturer's datasheet <https://www.onsemi.com/pub/Collateral/MBR0520LT1-D.PDF>; CREATED_BY: PCBLayout.com; DIGIKEY_PART_NUMBER: MBR0520LT1GOSTR-ND; MANUFACTURER: ON Semiconductor; MPN: MBR0520LT1G; PACKAGE: SOD-123
D5-D8 = Wurth_LEDs_WL-SFRW:WL-SFRW_1206_REC: WL-SFRW SMD Full-color Reverse mount Waterclear Characteristics RGB LED Ideal for narrow space applications Wide viewing angle Low power consumption Industry standard footprint Small package for exceptional brightness To emit light through a small cut-out hole in PCB Compatible with automatic placement machine Applications LED Front panel indicators LCD backlighting Backlighting for keypad, symbol and switch button <https://www.we-online.com/catalog/media/o135755v209%20Family_WL-SFRW.jpg> Details see: https://www.we-online.com/catalog/en/WL-SFRW/ Updated By Yingchun,Shan 2020-03-20 2020(C) Wurth Elektronik; ABSTRAHLWINKEL: 120°; CHIP-TECHNOLOGY: AlInGaP + InGaN; DATASHEET-URL: https://www.we-online.com/catalog/datasheet/156120M173000.pdf; EMITTING-COLOR: Red & Green & Blue; I-V-B-TYP: 250mcd; I-V-G-TYP: 700mcd; I-V-R-TYP: 270mcd; LAMDA-DOM-B-TYP: 470nm; LAMDA-DOM-G-TYP: 525nm; LAMDA-DOM-R-TYP: 624nm; LAMDA-PEAK-B-TYP: 468nm; LAMDA-PEAK-G-TYP: 520nm; LAMDA-PEAK-R-TYP: 632nm; PART-NUMBER: 156120M173000; V-F-B-TYP: 3.3V; V-F-G-TYP: 3.3V; V-F-R-TYP: 2.0V
GND RST TCK TDI TDO TMS = testpad:TP: Test pad
H1-H8 = holes:MOUNT-PAD-ROUND: MOUNTING PAD, round
J1 = Pascal_Library:USB41XX-GF-A
J2-J5 = SparkFun-Connectors:CONN_03X2: Multi connection point. Often used as Generic Header-pin footprint for 0.1 inch spaced/style header connections You can populate with any combo of single row headers, but if you'd like an exact match, check these: Header - 2x3 (Male, 0.1") <https://www.sparkfun.com/products/12807> (PRT-12807) Header - 2x3 (Female, 0.1") <https://www.sparkfun.com/products/13010> (PRT-13010) 2x3 Pin Shrouded Header <https://www.sparkfun.com/products/10877> (PRT-10877) On any of the 0.1 inch spaced packages, you can populate with these: Break Away Headers - Straight <https://www.sparkfun.com/products/116> (PRT-00116) Break Away Male Headers - Right Angle <https://www.sparkfun.com/products/553> (PRT-00553) Female Headers <https://www.sparkfun.com/products/115> (PRT-00115) Break Away Headers - Machine Pin <https://www.sparkfun.com/products/117> (PRT-00117) Break Away Female Headers - Swiss Machine Pin <https://www.sparkfun.com/products/743> (PRT-00743) Special note: the shrouded connector mates well with our 3x2 ribbon cables: Ribbon Crimp Connector - 6-pin (2x3, Female) <https://www.sparkfun.com/products/10651> (PRT-10651) Ribbon Cable - 6 wire (15ft) <https://www.sparkfun.com/products/10646> (PRT-10646); PROD_ID: CONN-11566; VALUE: FEMALE 2x3
J6 = SparkFun-Connectors:CONN_04X2: Multi connection point. Often used as Generic Header-pin footprint for 0.1 inch spaced/style header connections On any of the 0.1 inch spaced packages, you can populate with these: Break Away Headers - Straight <https://www.sparkfun.com/products/116> (PRT-00116) Break Away Male Headers - Right Angle <https://www.sparkfun.com/products/553> (PRT-00553) Female Headers <https://www.sparkfun.com/products/115> (PRT-00115) Break Away Headers - Machine Pin <https://www.sparkfun.com/products/117> (PRT-00117) Break Away Female Headers - Swiss Machine Pin <https://www.sparkfun.com/products/743> (PRT-00743)
J7 = SparkFun-Connectors:CONN_02: Multi connection point. Often used as Generic Header-pin footprint for 0.1 inch spaced/style header connections On any of the 0.1 inch spaced packages, you can populate with these: Break Away Headers - Straight <https://www.sparkfun.com/products/116> (PRT-00116) Break Away Male Headers - Right Angle <https://www.sparkfun.com/products/553> (PRT-00553) Female Headers <https://www.sparkfun.com/products/115> (PRT-00115) Break Away Headers - Machine Pin <https://www.sparkfun.com/products/117> (PRT-00117) Break Away Female Headers - Swiss Machine Pin <https://www.sparkfun.com/products/743> (PRT-00743) For SCREWTERMINALS and SPRING TERMINALS visit here: Screw Terimnals on SparkFun.com <https://www.sparkfun.com/search/results?term=Screw+Terminals> (5mm/3.5mm/2.54mm spacing) This device is also useful as a general connection point to wire up your design to another part of your project. Our various solder wires solder well into these plated through hole pads. Hook-Up Wire - Assortment (Stranded, 22 AWG) <https://www.sparkfun.com/products/11375> (PRT-11375) Hook-Up Wire - Assortment (Solid Core, 22 AWG) <https://www.sparkfun.com/products/11367> (PRT-11367) View the entire wire category on our website here <https://www.sparkfun.com/categories/141> Special notes: Molex polarized connector foot print use with: PRT-08233 with associated crimp pins and housings. 2.54_SCREWTERM for use with PRT-10571. 3.5mm Screw Terminal footprints for PRT-08084 5mm Screw Terminal footprints for use with PRT-08432
L1 = Elektroniker MGB:PTC_FUSE
L2 = Elektroniker MGB:L-COIL: Spule SMD Bauform 0805
L3 = Pascal_Library:L
L4 = Pascal_Library:750032050
N1-N4 = Pascal_Library:IN-8
Q1 = Elektroniker MGB:SIRA36DP
R1-R81 = rcl:R-EU_: RESISTOR, European symbol; SPICEPREFIX: R
S1 S2 = adafruit:31-XX: OMRON SWITCH Now with beefier pads!
S3 = SparkFun-Switches:MOMENTARY-SWITCH-SPST: Momentary Switch (Pushbutton) - SPST Normally-open (NO) SPST momentary switches (buttons, pushbuttons). Variants PTH-12MM - 12mm square, through-hole Momentary Pushbutton Switch - 12mm Square <https://www.sparkfun.com/products/9190> (COM-09190) PTH-6.0MM, PTH-6.0MM-KIT - 6.0mm square, through-hole Mini Pushbutton Switch <https://www.sparkfun.com/products/97> (COM-00097) KIT package intended for soldering kit's - only one side of pads' copper is exposed. PTH-RIGHT-ANGLE-KIT - Right-angle, through-hole Right Angle Tactile Button <https://www.sparkfun.com/products/10791> - Used on SparkFun BigTime Watch Kit <https://www.sparkfun.com/products/11734> SMD-12MM - 12mm square, surface-mount Tactile Button - SMD (12mm) <https://www.sparkfun.com/products/12993> (COM-12993) Used on SparkFun PicoBoard <https://www.sparkfun.com/products/11888> SMD-4.5MM - 4.5mm Square Trackball Switch Used on SparkFun Blackberry Trackballer Breakout <https://www.sparkfun.com/products/13169> SMD-4.6MMX2.8MM - 4.60mm x 2.80mm, surface mount Used on SparkFun SAMD21 Mini Breakout <https://www.sparkfun.com/products/13664> SMD-5.2MM, SMD-5.2-REDUNDANT - 5.2mm square, surface-mount Mini Pushbutton Switch - SMD <https://www.sparkfun.com/products/8720> (COM-08720) Used on Arduino Pro Mini <https://www.sparkfun.com/products/11114> REDUNDANT package connects both switch circuits together SMD-6.0X3.5MM - 6.0 x 3.5mm, surface mount Momentary Reset Switch SMD <https://www.sparkfun.com/products/8229> (COM-08229) SMD-6.2MM-TALL - 6.2mm square, surface mount Tactile Button - SMD (6mm) <https://www.sparkfun.com/products/12992> Used on SparkFun Digital Sandbox <https://www.sparkfun.com/products/12651> SMD-RIGHT-ANGLE - Right-angle, surface mount Used on SparkFun Block for Intel® Edison - Arduino <https://www.sparkfun.com/products/13036>; PROD_ID: SWCH-00815; SF_SKU: COM-08229
T1-T41 = Pascal_Library:MSD42WT1G
U1 = Elektroniker MGB:PRTR5V0U2X: PRTR5V0U2X - Ultra low capacitance double rail-to-rail ESD protection diode Ultra low capacitance rail-to-rail ElectroStatic Discharge (ESD) protection diode in a small SOT143B Surface-Mounted Device (SMD) plastic package designed to protect two Hi-Speed data lines or high-frequency signal lines from the damage caused by ESD and other transients. PRTR5V0U2X incorporates two pairs of ultra low capacitance rail-to-rail diodes as well as an additional ESD protection diode to ensure signal line protection even if no supply voltage is available.
U2 = Pascal_Library:MCP1603
U3 = Pascal_Library:LT3757: LT3757 / LT3757A - Boost, Flyback, SEPIC and Inverting Controller <https://www.analog.com/en/products/lt3757.html> The LT®3757/LT3757A are wide input range, current mode, DC/DC controllers which are capable of generating either positive or negative output voltages. They can be configured as either a boost, flyback, SEPIC or inverting converter. The LT3757/LT3757A drive a low side external N-channel power MOSFET from an internal regulated 7.2Vsupply. The fixed frequency, current-mode architecture results in stable operation over a wide range of supply and output voltages.
U4 = Pascal_Library:TPS22965
U5 = Pascal_Library:GD32VF103T
U6 = Pascal_Library:RV-3032-C7
U7-U9 = Pascal_Library:PCA9685: PCA9685 - 16 Channel 12-Bit I2C PWM Controller 5.0V tolerant 16 channel, 12-bit I2C PWM controller with 25mA per output (max. 400mA total) Digikey: 568-5931-1-ND
U$1-U$5 = Pascal_Library:LOGO_PASCAL_GESELL: Mein Logo halt
Y1 = SparkFun-Clocks:RESONATOR-8MHZ: 8MHz Resonator Digikey Example <http://www.digikey.com/product-detail/en/murata-electronics-north-america/CSTCE10M0G55-R0/490-1196-1-ND/584633> Frequency: 8MHz Frequency Stability: ±0.2% Frequency Tolerance: ±0.5% Capacitance: 33pF SparkFun Products Arduino Pro Mini 328- 3.3V/8MHz <https://www.sparkfun.com/products/11114> SparkFun Digital Sandbox <https://www.sparkfun.com/products/12651>; PROD_ID: XTAL-08895